# EAGLE schematic ELdrv (EAGLE 9.5.1)
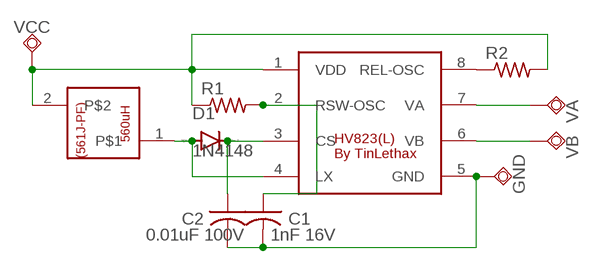
[diagram p0: schematic, sheet 1]

## Parts
C1  1nF 16V  C-USC0603K  [C0603K]
C2  0.01uF 100V  C-US025-040X050  [C025-040X050]
D1  1N4148  CGRM400-G  [SOD-123_MINI-SMA]
GND  TPSQTP20SQ  [TP20SQ]
L1  NL453232T-561J-PF  [INDC4526X50N]
R1  R-US_R0603  [R0603]
R2  R-US_R0603  [R0603]
U1  HV823  [SOIC127P600X175-9T200L]
VA  TPSQTP20SQ  [TP20SQ]
VB  TPSQTP20SQ  [TP20SQ]
VCC  TPSQTP20SQ  [TP20SQ]

## Nets
N$1: D1.A L1.1 U1.4(LX)
N$2: C2.1 D1.C U1.3(CS)
N$3: L1.2 R1.1 R2.2 U1.1(VDD) VCC.TP
N$4: C1.1 R1.2 U1.2(RSW-OSC)
N$5: R2.1 U1.8(REL-OSC)
N$6: C1.2 C2.2 GND.TP U1.5(GND)
N$7: U1.7(VA) VA.TP
N$8: U1.6(VB) VB.TP

## Library data of the parts
C1 C2 = adafruit:C-US: CAPACITOR, American symbol
D1 = diode:CGRM400*-G: Molded plasitc,JEDEC SOD-123/Mini SMA Source: Comchip CGRM4001-G.pdf
GND VA VB VCC = testpad:TPSQ: Test pad
L1 = 561J-PF:NL453232T-561J-PF
R1 R2 = adafruit:R-US_: RESISTOR, American symbol
U1 = HV823:HV823: The Supertex HV823 is a high-voltage driver designed for driving EL lamps of up to 50nF. EL lamps greater than 50nF can be driven for applications not requiring high brightness. The input supply voltage range is from 2.0V to 9.5V. The device uses a single inductor and a minimum number of passive components. The nominal regulated output voltage that is applied to the EL lamp is ±90V. The chip can be enabled by connecting the resistors on the RSW-Osc pin and the REL-Osc pin to the VDD pin, and disabled when connected to GND.; PACKAGE: 8-SOIC; PARTNO: HV823